# Altium project GeekIMU.PrjPCB
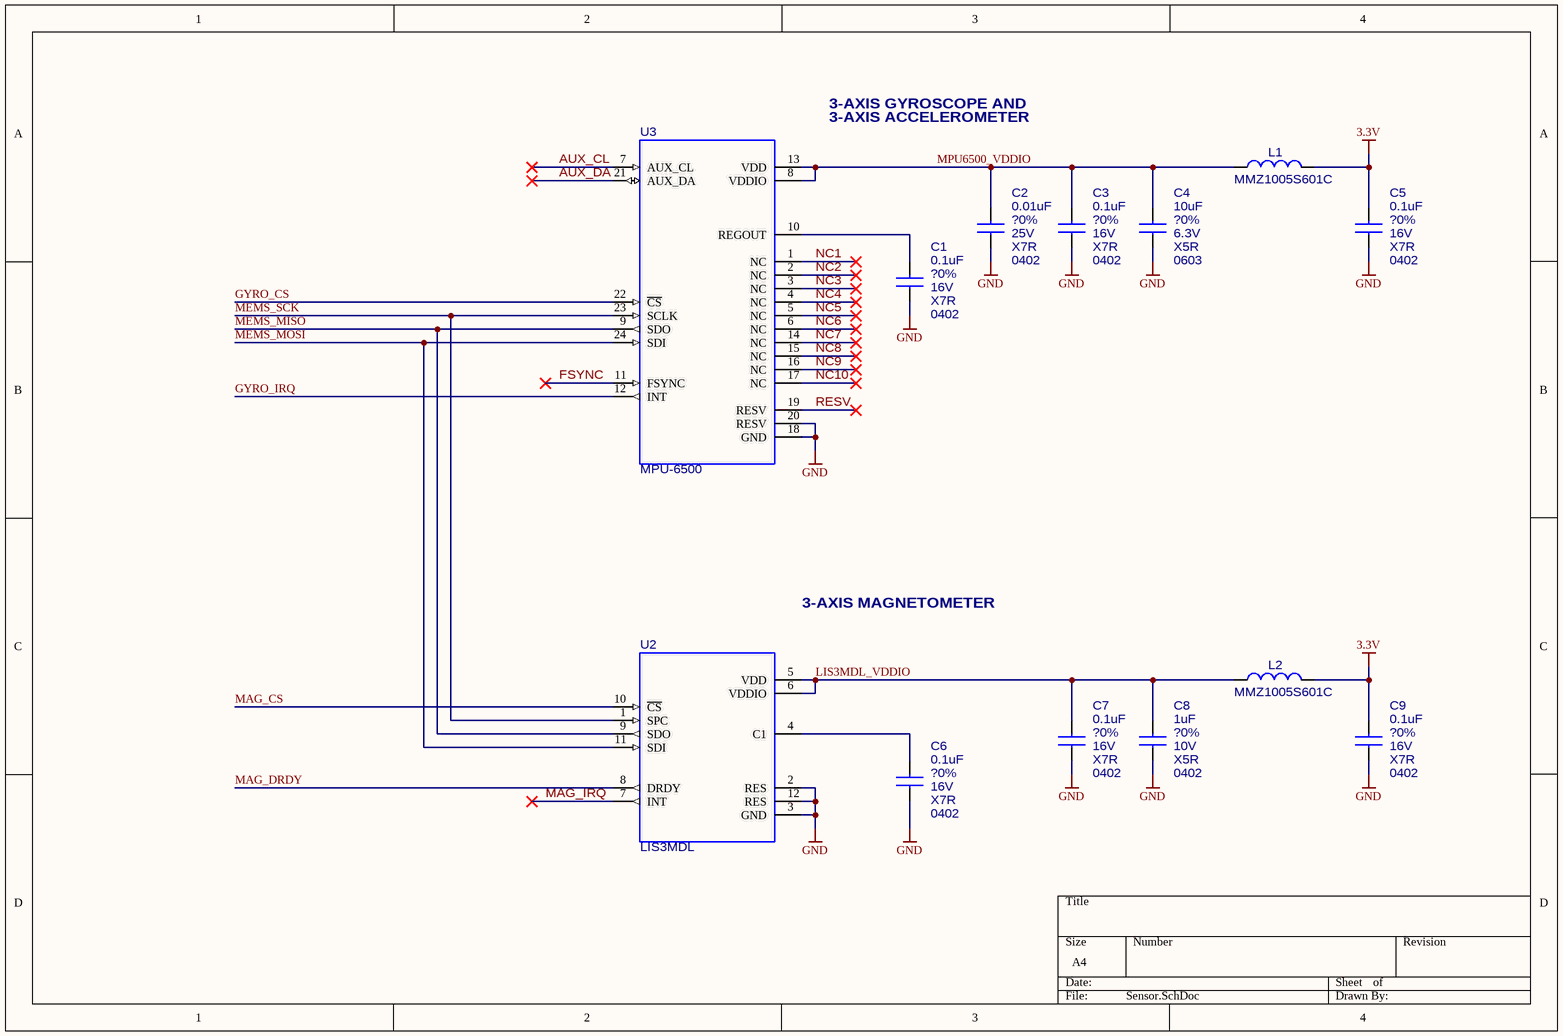
[diagram p0: Sensor.SchDoc]
4 sheets, 41 parts. Net scope: global (net labels, ports and power ports of the same name join across sheets).
Board file: GeekIMU.PcbDoc
Sheets:
  Sensor.SchDoc
  Power.SchDoc
  MCU.SchDoc
  USB.SchDoc

## Sheet Sensor.SchDoc
size A4

### Parts
C1  0.1uF  Tolerance: ?0%  Voltage: 16V  Dielectric: X7R  Package: 0402  [CAP_CERAMIC_0402]
C2  0.01uF  Tolerance: ?0%  Voltage: 25V  Dielectric: X7R  Package: 0402  [CAP_CERAMIC_0402]
C3  0.1uF  Tolerance: ?0%  Voltage: 16V  Dielectric: X7R  Package: 0402  [CAP_CERAMIC_0402]
C4  10uF  Tolerance: ?0%  Voltage: 6.3V  Dielectric: X5R  Package: 0603  [CAP_CERAMIC_0603]
C5  0.1uF  Tolerance: ?0%  Voltage: 16V  Dielectric: X7R  Package: 0402  [CAP_CERAMIC_0402]
C6  0.1uF  Tolerance: ?0%  Voltage: 16V  Dielectric: X7R  Package: 0402  [CAP_CERAMIC_0402]
C7  0.1uF  Tolerance: ?0%  Voltage: 16V  Dielectric: X7R  Package: 0402  [CAP_CERAMIC_0402]
C8  1uF  Tolerance: ?0%  Voltage: 10V  Dielectric: X5R  Package: 0402  [CAP_CERAMIC_0402]
C9  0.1uF  Tolerance: ?0%  Voltage: 16V  Dielectric: X7R  Package: 0402  [CAP_CERAMIC_0402]
L1  MMZ1005S601C  [INDUCTOR_0402]
L2  MMZ1005S601C  [INDUCTOR_0402]
U2  LIS3MDL  [LGA-12]
U3  MPU-6500  [QFN-24]

### Nets
3.3V: C5.1 C9.1 L1.2 L2.2
GND: C1.2 C2.2 C3.2 C4.2 C5.2 C6.2 C7.2 C8.2 C9.2 U2.2(RES) U2.3(GND) U2.12(RES) U3.18(GND) U3.20(RESV)
AUX_CL: U3.7(AUX_CL)
AUX_DA: U3.21(AUX_DA)
FSYNC: U3.11(FSYNC)
GYRO_CS: U3.22(~{CS})
GYRO_IRQ: U3.12(INT)
LIS3MDL_VDDIO: C7.1 C8.1 L2.1 U2.5(VDD) U2.6(VDDIO)
MAG_CS: U2.10(~{CS})
MAG_DRDY: U2.8(DRDY)
MAG_IRQ: U2.7(INT)
MEMS_MISO: U2.9(SDO) U3.9(SDO)
MEMS_MOSI: U2.11(SDI) U3.24(SDI)
MEMS_SCK: U2.1(SPC) U3.23(SCLK)
MPU6500_VDDIO: C2.1 C3.1 C4.1 L1.1 U3.8(VDDIO) U3.13(VDD)
NC1: U3.1(NC)
NC2: U3.2(NC)
NC3: U3.3(NC)
NC4: U3.4(NC)
NC5: U3.5(NC)
NC6: U3.6(NC)
NC7: U3.14(NC)
NC8: U3.15(NC)
NC9: U3.16(NC)
NC10: U3.17(NC)
RESV: U3.19(RESV)
NetC1_1: C1.1 U3.10(REGOUT)
NetC6_1: C6.1 U2.4(C1)

### Notes on the sheet
- 3-AXIS GYROSCOPE AND
- (near U3) 3-AXIS ACCELEROMETER
- 3-AXIS MAGNETOMETER

### Library data of the parts
C1 C3 C5-C7 C9 = CAP, CERAMIC: CAP, CERAMIC, 0.1uF, ?0%, 16V, X7R, 0402; Manufacturer: MURATA ELECTRONICS; Part Number: GRM155R71C104KA88D
C2 = CAP, CERAMIC: CAP, CERAMIC, 0.01uF, ?0%, 25V, X7R, 0402; Manufacturer: MURATA ELECTRONICS; Part Number: GRM155R71E103KA01D
C4 = CAP, CERAMIC: CAP, CERAMIC, 10uF, ?0%, 6.3V, X5R, 0603; Manufacturer: MURATA ELECTRONICS; Part Number: GRM188R60J106ME47D
C8 = CAP, CERAMIC: CAP, CERAMIC, 1uF, ?0%, 10V, X5R, 0402; Manufacturer: MURATA ELECTRONICS; Part Number: GRM155R61A105KE15D
L1 L2 = INDUCTOR: FERRITE CHIP BEAD, 600 OHM @ 100MHz, 300mA, 0402; Manufacturer: TDK CORPORATION; Part Number: MMZ1005S601C; Package: 0402
U2 = LIS3MDL: IC, MEMS 3 AXIS MAGNETOMETER; Manufacturer: STMICROELECTRONICS; Part Number: LIS3MDLTR; Verified Pinout: *
U3 = MPU-6500: IC, MEMS 3 AXIS GYROSCOPE AND 3 AXIS ACCELEROMETER; Manufacturer: INVENSENSE; Part Number: MPU-6500; Verified Pinout: *; Updated: *

## Sheet Power.SchDoc
size A4
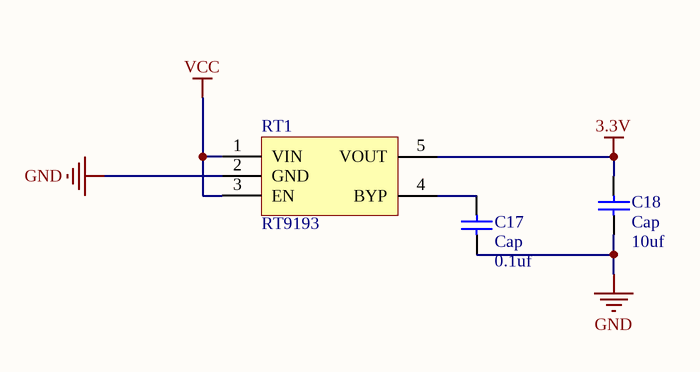
[diagram p1: Power.SchDoc]

### Parts
C17  Cap  value 0.1uf  [CAP_0402]
C18  Cap  value 10uf  [CAP_0603]
RT1  RT9193  [SOT23-5L]

### Nets
3.3V: C18.2 RT1.5(VOUT)
GND: C17.1 C18.1 RT1.2(GND)
VCC: RT1.1(VIN) RT1.3(EN)
NetC17_2: C17.2 RT1.4(BYP)

### Library data of the parts
C17 C18 = Cap: Capacitor; Published: 8-Jun-2000; LatestRevisionDate: 17-Jul-2002; LatestRevisionNote: Re-released for DXP Platform.; PackageReference: RAD-0.3; Publisher: Altium Limited; PackageDescription: Radial Cap, Thru-Hole; 2 Leads; 0.3 in Pin Spacing
RT1 = RT9193: Power

## Sheet MCU.SchDoc
size A4
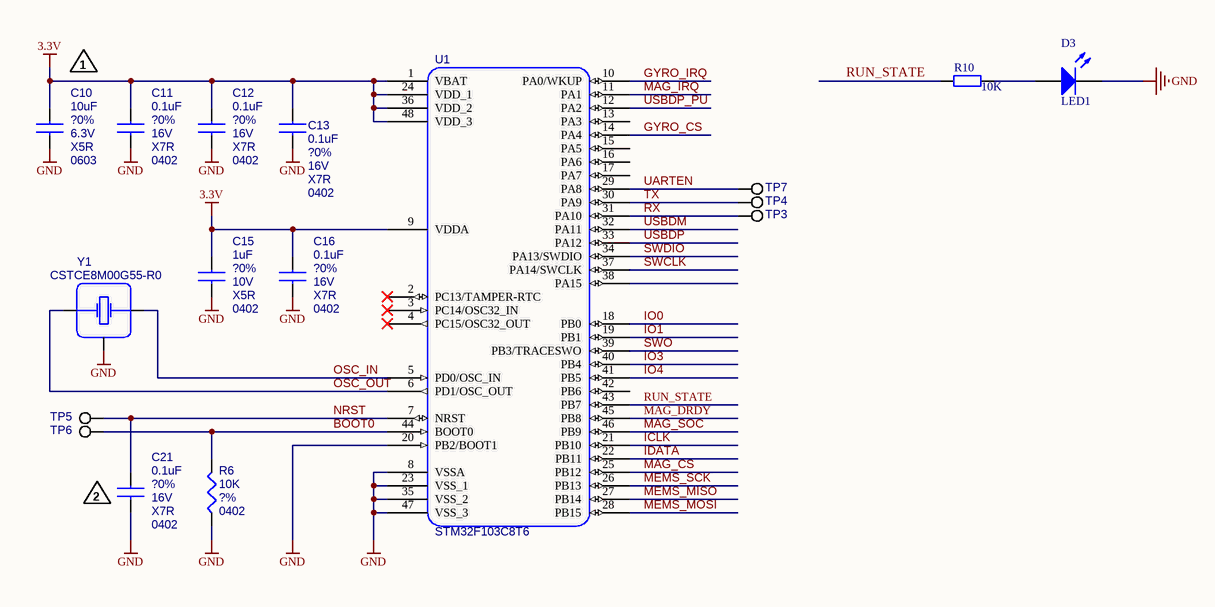
[diagram p2: MCU.SchDoc]

### Parts
C10  10uF  Tolerance: ?0%  Voltage: 6.3V  Dielectric: X5R  Package: 0603  [CAP_CERAMIC_0603]
C11  0.1uF  Tolerance: ?0%  Voltage: 16V  Dielectric: X7R  Package: 0402  [CAP_CERAMIC_0402]
C12  0.1uF  Tolerance: ?0%  Voltage: 16V  Dielectric: X7R  Package: 0402  [CAP_CERAMIC_0402]
C13  0.1uF  Tolerance: ?0%  Voltage: 16V  Dielectric: X7R  Package: 0402  [CAP_0402]
C15  1uF  Tolerance: ?0%  Voltage: 10V  Dielectric: X5R  Package: 0402  [CAP_CERAMIC_0402]
C16  0.1uF  Tolerance: ?0%  Voltage: 16V  Dielectric: X7R  Package: 0402  [CAP_CERAMIC_0402]
C21  0.1uF  Tolerance: ?0%  Voltage: 16V  Dielectric: X7R  Package: 0402  [CAP_CERAMIC_0402]
D3  LED1  [CAP_CERAMIC_0402]
R6  10K  Package: 0402  Tolerance: ?%  [RESISTOR_0402]
R10  value 10K  [RESISTOR_0402]
TP3  TEST POINT  [TEST_POINT_PAD]  (value not drawn)  (no BOM)
TP4  TEST POINT  [TEST_POINT_PAD]  (value not drawn)  (no BOM)
TP5  TEST POINT  [TEST_POINT_PAD]  (value not drawn)  (no BOM)
TP6  TEST POINT  [TEST_POINT_PAD]  (value not drawn)  (no BOM)
TP7  TEST POINT  [TEST_POINT_PAD]  (value not drawn)  (no BOM)
U1  STM32F103C8T6  [LQFP48]
Y1  CSTCE8M00G55-R0  [CSTCE]

### Nets
3.3V: C10.1 C11.1 C12.1 C13.2 C15.1 C16.1 U1.1(VBAT) U1.9(VDDA) U1.24(VDD_1) U1.36(VDD_2) U1.48(VDD_3)
GND: C10.2 C11.2 C12.2 C13.1 C15.2 C16.2 C21.2 D3.2(K) R6.1 U1.8(VSSA) U1.20(PB2/BOOT1) U1.23(VSS_1) U1.35(VSS_2) U1.47(VSS_3) Y1.2(GND)
BOOT0: R6.2 TP6.1 U1.44(BOOT0)
GYRO_CS: U1.14(PA4)
GYRO_IRQ: U1.10(PA0/WKUP)
ICLK: U1.21(PB10)
IDATA: U1.22(PB11)
IO0: U1.18(PB0)
IO1: U1.19(PB1)
IO3: U1.40(PB4)
IO4: U1.41(PB5)
MAG_CS: U1.25(PB12)
MAG_DRDY: U1.45(PB8)
MAG_IRQ: U1.11(PA1)
MAG_SOC: U1.46(PB9)
MEMS_MISO: U1.27(PB14)
MEMS_MOSI: U1.28(PB15)
MEMS_SCK: U1.26(PB13)
NRST: C21.1 TP5.1 U1.7(NRST)
OSC_IN: U1.5(PD0/OSC_IN) Y1.3
OSC_OUT: U1.6(PD1/OSC_OUT) Y1.1
RUN_STATE: R10.2 U1.43(PB7)
RX: TP3.1 U1.31(PA10)
SWCLK: U1.37(PA14/SWCLK)
SWDIO: U1.34(PA13/SWDIO)
SWO: U1.39(PB3/TRACESWO)
TX: TP4.1 U1.30(PA9)
UARTEN: TP7.1 U1.29(PA8)
USBDM: U1.32(PA11)
USBDP: U1.33(PA12)
USBDP_PU: U1.12(PA2)
NetD3_1: D3.1(A) R10.1

Not connected (* = marked no-connect by the designer): U1 2(PC13/TAMPER-RTC)* 3(PC14/OSC32_IN)* 4(PC15/OSC32_OUT)* 13(PA3) 15(PA5) 16(PA6) 17(PA7) 38(PA15) 42(PB6)

### Notes on the sheet
- 1
- (near C21) 2

### Library data of the parts
C10 = CAP, CERAMIC: as C4 on sheet Sensor
C11-C13 C16 C21 = CAP, CERAMIC: as C1 on sheet Sensor
C15 = CAP, CERAMIC: as C8 on sheet Sensor
D3 = LED1: Typical RED GaAs LED; Published: 8-Jun-2000; LatestRevisionDate: 08-Jul-2005; LatestRevisionNote: Mech Layer 1 removed.; PackageReference: LED-1; Publisher: Altium Limited
R6 = RESISTOR: RES, 10K OHM, 1/10W, ?%, 0402; Manufacturer: PANASONIC; Part Number: ERJ-2RKF1002X; Power Rating: 1/10W
R10 = Res2: Resistor; Published: 8-Jun-2000; LatestRevisionDate: 17-Jul-2002; LatestRevisionNote: Re-released for DXP Platform.; PackageReference: AXIAL-0.4; Publisher: Altium Limited
TP3-TP7 = TEST_POINT: Manufacturer: *; Part Number: *
U1 = STM32F103C8T6: IC, STM32 MICROCONTROLLER, ARM CORTEX M3; Manufacturer: ST MICROELECTRONICS; Part Number: STM32F103C8T6; Verified Pinout: *
Y1 = CSTCE8M00G55-R0: CERAMIC RESONATOR, 8MHz, +/-0.2%, 33pF, SMD; Manufacturer: MURATA ELECTRONICS; Part Number: CSTCE8M00G55-R0; Pinout Verified: *

## Sheet USB.SchDoc
size A4
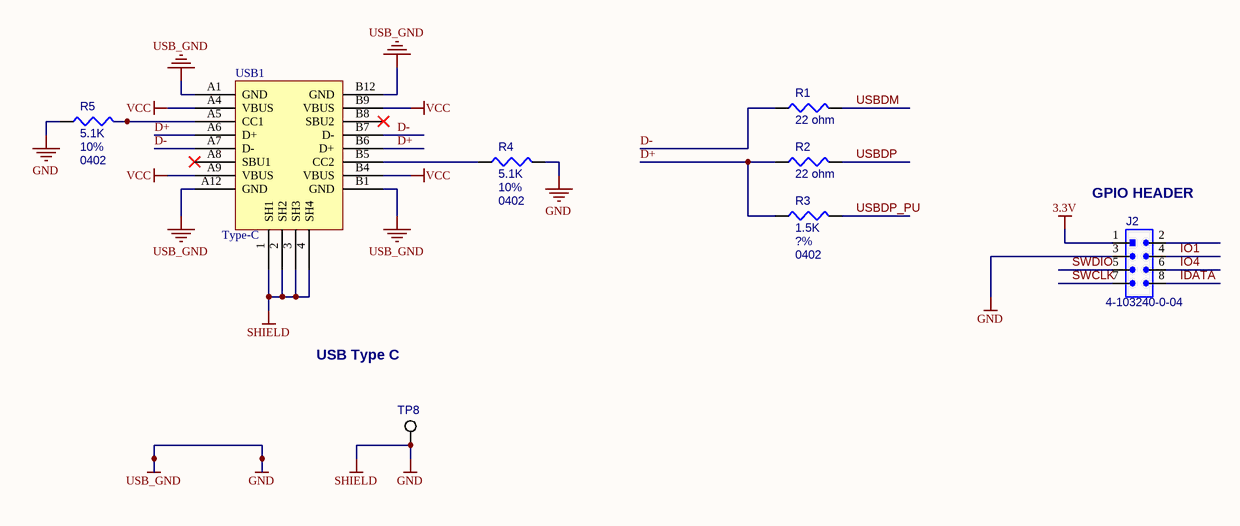
[diagram p3: USB.SchDoc]

### Parts
J2  4-103240-0-04  [4-103240-0-04]
R1  22 ohm  [RESISTOR_0402]
R2  22 ohm  [RESISTOR_0402]
R3  1.5K  Package: 0402  Tolerance: ?%  [RESISTOR_0402]
R4  5.1K  Package: 0402  Tolerance: 10%  [RES_0402]
R5  5.1K  Package: 0402  误差: 10%  [RES_0402]
TP8  TEST POINT  [TEST_POINT_PAD]  (value not drawn)  (no BOM)
USB1  Type-C  [Type-C-TOP]

### Nets
3.3V: J2.1
GND: J2.3 R4.2 R5.1 TP8.1 USB1.1(SH1) USB1.2(SH2) USB1.3(SH3) USB1.4(SH4) USB1.A1(GND) USB1.A12(GND) USB1.B1(GND) USB1.B12(GND)  [also labelled SHIELD, USB_GND]
VCC: USB1.A4(VBUS) USB1.A9(VBUS) USB1.B4(VBUS) USB1.B9(VBUS)
D+: R2.1 R3.1 USB1.A6(D+) USB1.B6(D+)
D-: R1.1 USB1.A7(D-) USB1.B7(D-)
IDATA: J2.8
IO1: J2.4
IO4: J2.6
SWCLK: J2.7
SWDIO: J2.5
USBDM: R1.2
USBDP: R2.2
USBDP_PU: R3.2
NetR4_1: R4.1 USB1.B5(CC2)
NetR5_2: R5.2 USB1.A5(CC1)

Not connected (* = marked no-connect by the designer): J2 2; USB1 A8(SBU1)* B8(SBU2)*

### Notes on the sheet
- (near J2) GPIO HEADER
- USB Type C

### Library data of the parts
J2 = 4-103240-0-04: CONNECTOR, HEADER, 2X4, 0.1" PITCH; Manufacturer: TE CONNECTIVITY; Part Number: 4-103240-0-04; Pitch: 0.1"
R1 R2 = RESISTOR: RES, 22 OHM, 1/10W, ?%, 0402; Manufacturer: PANASONIC; Part Number: ERJ-2RKF22R0X; Power Rating: 1/10W; Package: 0402; Tolerance: ?%
R3-R5 = RESISTOR: RES, 1.5K OHM, 1/10W, ?%, 0402; Manufacturer: PANASONIC; Part Number: ERJ-2RKF1501X; Power Rating: 1/10W
TP8 = TEST_POINT: Manufacturer: *; Part Number: *
USB1 = USB-Type-C-TOP-16P: 16脚USB TypeC

## Nets that join several sheets
3.3V: Sensor (C5.1 C9.1 L1.2 L2.2), Power (C18.2 RT1.5), MCU (11 pins), USB (J2.1)
GND: Sensor (14 pins), Power (C17.1 C18.1 RT1.2), MCU (15 pins), USB (12 pins)
VCC: Power (RT1.1 RT1.3), USB (USB1.A4 USB1.A9 USB1.B4 USB1.B9)
GYRO_CS: Sensor (U3.22), MCU (U1.14)
GYRO_IRQ: Sensor (U3.12), MCU (U1.10)
IDATA: MCU (U1.22), USB (J2.8)
IO1: MCU (U1.19), USB (J2.4)
IO4: MCU (U1.41), USB (J2.6)
MAG_CS: Sensor (U2.10), MCU (U1.25)
MAG_DRDY: Sensor (U2.8), MCU (U1.45)
MAG_IRQ: Sensor (U2.7), MCU (U1.11)
MEMS_MISO: Sensor (U2.9 U3.9), MCU (U1.27)
MEMS_MOSI: Sensor (U2.11 U3.24), MCU (U1.28)
MEMS_SCK: Sensor (U2.1 U3.23), MCU (U1.26)
SWCLK: MCU (U1.37), USB (J2.7)
SWDIO: MCU (U1.34), USB (J2.5)
USBDM: MCU (U1.32), USB (R1.2)
USBDP: MCU (U1.33), USB (R2.2)
USBDP_PU: MCU (U1.12), USB (R3.2)